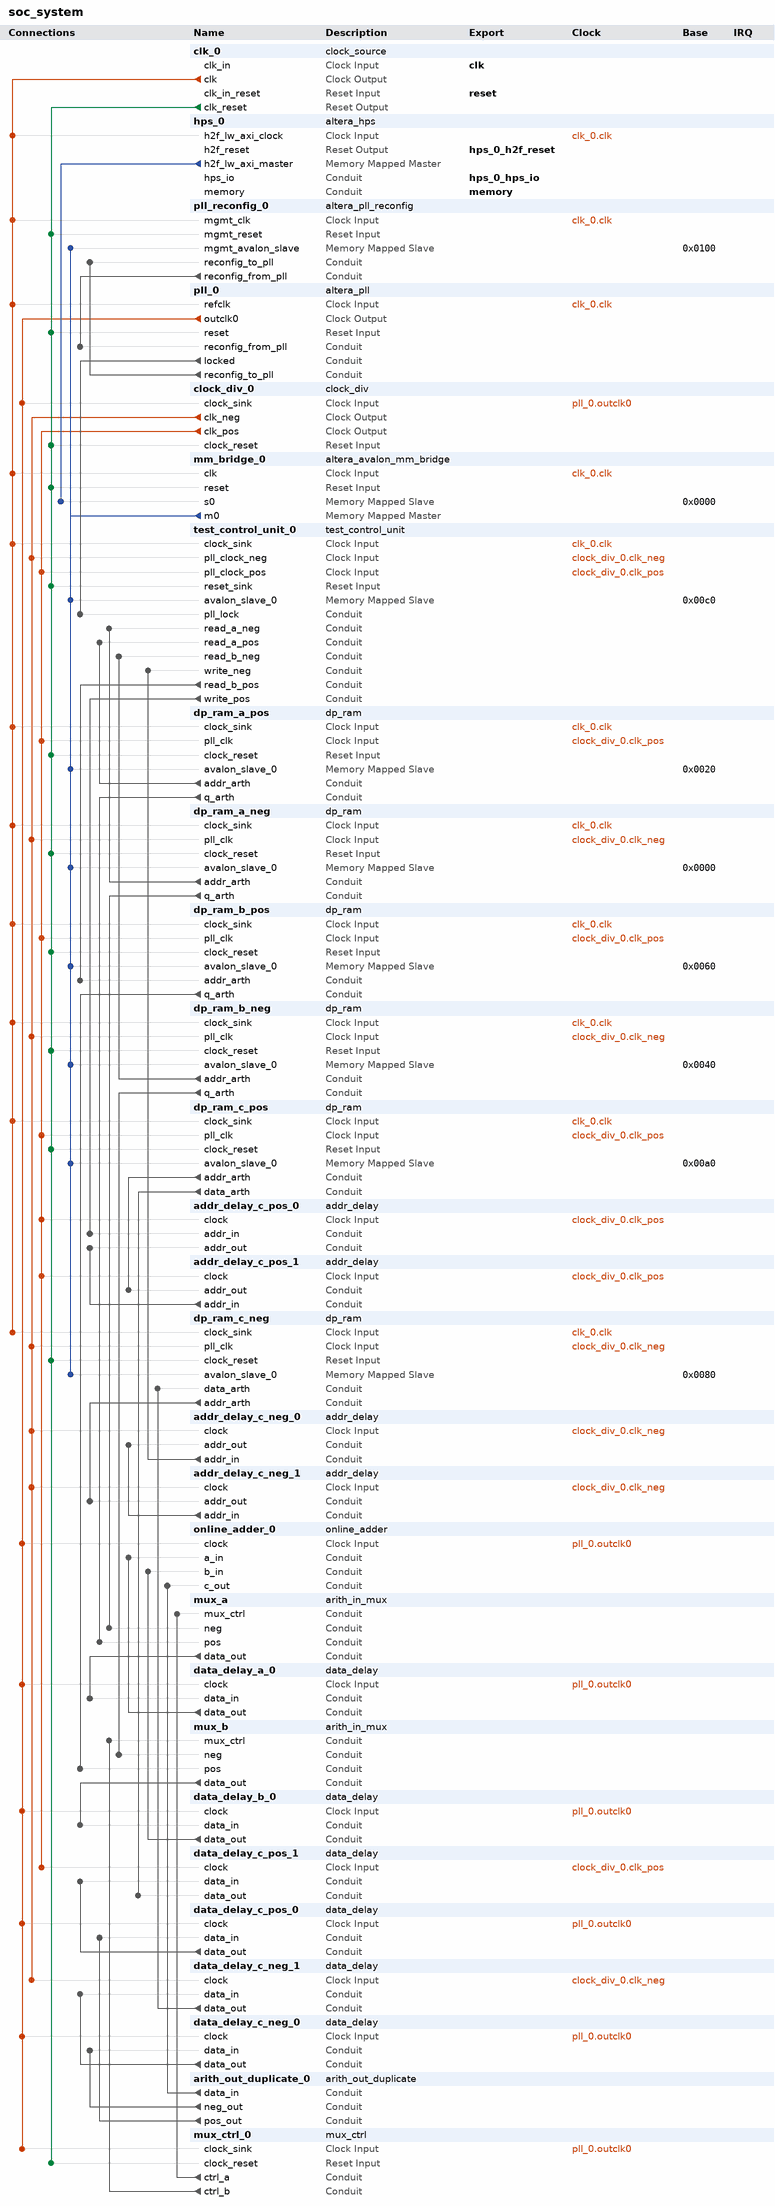
[diagram p0: system contents]
# Platform Designer (Qsys) system soc_system, Cyclone V 5CSXFC6D6F31C6
# Parameters at their usual value, and those the tool derives, are not listed.
package require -exact qsys 20.1
create_system soc_system
set_project_property DEVICE_FAMILY {Cyclone V}
set_project_property DEVICE 5CSXFC6D6F31C6

add_instance clk_0 clock_source 20.1
set_instance_parameter_value clk_0 clockFrequency 50000000

add_instance hps_0 altera_hps 20.1
set_instance_parameter_value hps_0 CAN0_Mode CAN
set_instance_parameter_value hps_0 CAN0_PinMuxing {HPS I/O Set 0}
set_instance_parameter_value hps_0 EMAC1_Mode RGMII
set_instance_parameter_value hps_0 EMAC1_PinMuxing {HPS I/O Set 0}
set_instance_parameter_value hps_0 F2SCLK_COLDRST_Enable false
set_instance_parameter_value hps_0 F2SCLK_DBGRST_Enable false
set_instance_parameter_value hps_0 F2SCLK_WARMRST_Enable false
set_instance_parameter_value hps_0 F2SINTERRUPT_Enable false
set_instance_parameter_value hps_0 F2S_Width 0
set_instance_parameter_value hps_0 FPGA_PERIPHERAL_OUTPUT_CLOCK_FREQ_EMAC0_GTX_CLK 100
set_instance_parameter_value hps_0 FPGA_PERIPHERAL_OUTPUT_CLOCK_FREQ_EMAC0_MD_CLK 100.0
set_instance_parameter_value hps_0 FPGA_PERIPHERAL_OUTPUT_CLOCK_FREQ_EMAC1_GTX_CLK 100
set_instance_parameter_value hps_0 FPGA_PERIPHERAL_OUTPUT_CLOCK_FREQ_EMAC1_MD_CLK 100.0
set_instance_parameter_value hps_0 HPS_PROTOCOL DDR3
set_instance_parameter_value hps_0 I2C0_Mode I2C
set_instance_parameter_value hps_0 I2C0_PinMuxing {HPS I/O Set 1}
set_instance_parameter_value hps_0 I2C1_Mode N/A
set_instance_parameter_value hps_0 I2C1_PinMuxing Unused
set_instance_parameter_value hps_0 LWH2F_Enable true
set_instance_parameter_value hps_0 MEM_BANKADDR_WIDTH 3
set_instance_parameter_value hps_0 MEM_CLK_FREQ 400.0
set_instance_parameter_value hps_0 MEM_COL_ADDR_WIDTH 10
set_instance_parameter_value hps_0 MEM_DQ_WIDTH 40
set_instance_parameter_value hps_0 MEM_DRV_STR RZQ/6
set_instance_parameter_value hps_0 MEM_ROW_ADDR_WIDTH 15
set_instance_parameter_value hps_0 MEM_RTT_NOM RZQ/6
set_instance_parameter_value hps_0 MEM_RTT_WR {Dynamic ODT off}
set_instance_parameter_value hps_0 MEM_TCL 7
set_instance_parameter_value hps_0 MEM_TFAW_NS 30.0
set_instance_parameter_value hps_0 MEM_TRAS_NS 35.0
set_instance_parameter_value hps_0 MEM_TRCD_NS 13.75
set_instance_parameter_value hps_0 MEM_TRFC_NS 260.0
set_instance_parameter_value hps_0 MEM_TRP_NS 13.75
set_instance_parameter_value hps_0 MEM_TRRD_NS 10.0
set_instance_parameter_value hps_0 MEM_TRTP_NS 10.0
set_instance_parameter_value hps_0 MEM_VENDOR JEDEC
set_instance_parameter_value hps_0 MEM_WTCL 6
set_instance_parameter_value hps_0 QSPI_Mode {1 SS}
set_instance_parameter_value hps_0 QSPI_PinMuxing {HPS I/O Set 0}
set_instance_parameter_value hps_0 REF_CLK_FREQ 25.0
set_instance_parameter_value hps_0 S2FCLK_USER2CLK 5
set_instance_parameter_value hps_0 S2F_Width 0
set_instance_parameter_value hps_0 SDIO_Mode {4-bit Data}
set_instance_parameter_value hps_0 SDIO_PinMuxing {HPS I/O Set 0}
set_instance_parameter_value hps_0 SPIM0_Mode {Single Slave Select}
set_instance_parameter_value hps_0 SPIM0_PinMuxing {HPS I/O Set 0}
set_instance_parameter_value hps_0 SPIM1_Mode N/A
set_instance_parameter_value hps_0 SPIM1_PinMuxing Unused
set_instance_parameter_value hps_0 STM_Enable false
set_instance_parameter_value hps_0 TIMING_BOARD_AC_SKEW 0.02
set_instance_parameter_value hps_0 TIMING_BOARD_AC_TO_CK_SKEW 0.0
set_instance_parameter_value hps_0 TIMING_BOARD_DQ_TO_DQS_SKEW 0.0
set_instance_parameter_value hps_0 TIMING_BOARD_MAX_CK_DELAY 0.6
set_instance_parameter_value hps_0 TIMING_BOARD_MAX_DQS_DELAY 0.6
set_instance_parameter_value hps_0 TIMING_BOARD_SKEW_BETWEEN_DQS 0.02
set_instance_parameter_value hps_0 TIMING_BOARD_SKEW_CKDQS_DIMM_MAX 0.01
set_instance_parameter_value hps_0 TIMING_BOARD_SKEW_CKDQS_DIMM_MIN -0.01
set_instance_parameter_value hps_0 TIMING_BOARD_SKEW_WITHIN_DQS 0.02
set_instance_parameter_value hps_0 TIMING_TDH 45
set_instance_parameter_value hps_0 TIMING_TDQSCK 225
set_instance_parameter_value hps_0 TIMING_TDQSQ 100
set_instance_parameter_value hps_0 TIMING_TDQSS 0.27
set_instance_parameter_value hps_0 TIMING_TDS 10
set_instance_parameter_value hps_0 TIMING_TDSH 0.18
set_instance_parameter_value hps_0 TIMING_TDSS 0.18
set_instance_parameter_value hps_0 TIMING_TIH 120
set_instance_parameter_value hps_0 TIMING_TIS 170
set_instance_parameter_value hps_0 TIMING_TQSH 0.4
set_instance_parameter_value hps_0 TRACE_Mode HPS
set_instance_parameter_value hps_0 TRACE_PinMuxing {HPS I/O Set 0}
set_instance_parameter_value hps_0 UART0_Mode {No Flow Control}
set_instance_parameter_value hps_0 UART0_PinMuxing {HPS I/O Set 2}
set_instance_parameter_value hps_0 USB1_Mode SDR
set_instance_parameter_value hps_0 USB1_PinMuxing {HPS I/O Set 0}
set_instance_parameter_value hps_0 desired_cfg_clk_mhz 123.333333
set_instance_parameter_value hps_0 desired_qspi_clk_mhz 370.0

add_instance pll_reconfig_0 altera_pll_reconfig 20.1

add_instance pll_0 altera_pll 20.1
set_instance_parameter_value pll_0 gui_device_speed_grade 1
set_instance_parameter_value pll_0 gui_en_adv_params true
set_instance_parameter_value pll_0 gui_en_reconf true
set_instance_parameter_value pll_0 gui_number_of_clocks 1
set_instance_parameter_value pll_0 gui_operation_mode normal
set_instance_parameter_value pll_0 gui_output_clock_frequency0 100.0
set_instance_parameter_value pll_0 gui_pll_mode {Fractional-N PLL}
set_instance_parameter_value pll_0 gui_reference_clock_frequency 50.0
set_instance_parameter_value pll_0 gui_use_locked true

add_instance clock_div_0 clock_div 1.0

add_instance mm_bridge_0 altera_avalon_mm_bridge 20.1
set_instance_parameter_value mm_bridge_0 ADDRESS_UNITS SYMBOLS
set_instance_parameter_value mm_bridge_0 ADDRESS_WIDTH 10
set_instance_parameter_value mm_bridge_0 DATA_WIDTH 32
set_instance_parameter_value mm_bridge_0 MAX_PENDING_RESPONSES 4
set_instance_parameter_value mm_bridge_0 USE_AUTO_ADDRESS_WIDTH 1

add_instance test_control_unit_0 test_control_unit 1.0
set_instance_parameter_value test_control_unit_0 ID 1

add_instance dp_ram_a_pos dp_ram 1.0
set_instance_parameter_value dp_ram_a_pos ID 2
set_instance_parameter_value dp_ram_a_pos NEG_EDGE 0

add_instance dp_ram_a_neg dp_ram 1.0
set_instance_parameter_value dp_ram_a_neg ID 3
set_instance_parameter_value dp_ram_a_neg NEG_EDGE 0

add_instance dp_ram_b_pos dp_ram 1.0
set_instance_parameter_value dp_ram_b_pos ID 4
set_instance_parameter_value dp_ram_b_pos NEG_EDGE 0

add_instance dp_ram_b_neg dp_ram 1.0
set_instance_parameter_value dp_ram_b_neg ID 5
set_instance_parameter_value dp_ram_b_neg NEG_EDGE 0

add_instance dp_ram_c_pos dp_ram 1.0
set_instance_parameter_value dp_ram_c_pos ID 6
set_instance_parameter_value dp_ram_c_pos NEG_EDGE 0

add_instance addr_delay_c_pos_0 addr_delay 1.0
set_instance_parameter_value addr_delay_c_pos_0 ADDR_WIDTH 11

add_instance addr_delay_c_pos_1 addr_delay 1.0
set_instance_parameter_value addr_delay_c_pos_1 ADDR_WIDTH 11

add_instance dp_ram_c_neg dp_ram 1.0
set_instance_parameter_value dp_ram_c_neg ID 7
set_instance_parameter_value dp_ram_c_neg NEG_EDGE 0

add_instance addr_delay_c_neg_0 addr_delay 1.0
set_instance_parameter_value addr_delay_c_neg_0 ADDR_WIDTH 11

add_instance addr_delay_c_neg_1 addr_delay 1.0
set_instance_parameter_value addr_delay_c_neg_1 ADDR_WIDTH 11

add_instance online_adder_0 online_adder 1.0
set_instance_parameter_value online_adder_0 RADIX 2
set_instance_parameter_value online_adder_0 WIDTH 15

add_instance mux_a arith_in_mux 1.0
set_instance_parameter_value mux_a WIDTH 30

add_instance data_delay_a_0 data_delay 1.0
set_instance_parameter_value data_delay_a_0 WIDTH 30

add_instance mux_b arith_in_mux 1.0
set_instance_parameter_value mux_b WIDTH 30

add_instance data_delay_b_0 data_delay 1.0
set_instance_parameter_value data_delay_b_0 WIDTH 30

add_instance data_delay_c_pos_1 data_delay 1.0
set_instance_parameter_value data_delay_c_pos_1 WIDTH 32

add_instance data_delay_c_pos_0 data_delay 1.0
set_instance_parameter_value data_delay_c_pos_0 WIDTH 32

add_instance data_delay_c_neg_1 data_delay 1.0
set_instance_parameter_value data_delay_c_neg_1 WIDTH 32

add_instance data_delay_c_neg_0 data_delay 1.0
set_instance_parameter_value data_delay_c_neg_0 WIDTH 32

add_instance arith_out_duplicate_0 arith_out_duplicate 1.0
set_instance_parameter_value arith_out_duplicate_0 WIDTH 32

add_instance mux_ctrl_0 mux_ctrl 1.0

# connections
add_connection clk_0.clk dp_ram_a_neg.clock_sink clock
add_connection clk_0.clk dp_ram_a_pos.clock_sink clock
add_connection clk_0.clk dp_ram_b_neg.clock_sink clock
add_connection clk_0.clk dp_ram_b_pos.clock_sink clock
add_connection clk_0.clk dp_ram_c_neg.clock_sink clock
add_connection clk_0.clk dp_ram_c_pos.clock_sink clock
add_connection clk_0.clk hps_0.h2f_lw_axi_clock clock
add_connection clk_0.clk mm_bridge_0.clk clock
add_connection clk_0.clk pll_0.refclk clock
add_connection clk_0.clk pll_reconfig_0.mgmt_clk clock
add_connection clk_0.clk test_control_unit_0.clock_sink clock
add_connection clock_div_0.clk_neg addr_delay_c_neg_0.clock clock
add_connection clock_div_0.clk_neg addr_delay_c_neg_1.clock clock
add_connection clock_div_0.clk_neg data_delay_c_neg_1.clock clock
add_connection clock_div_0.clk_neg dp_ram_a_neg.pll_clk clock
add_connection clock_div_0.clk_neg dp_ram_b_neg.pll_clk clock
add_connection clock_div_0.clk_neg dp_ram_c_neg.pll_clk clock
add_connection clock_div_0.clk_neg test_control_unit_0.pll_clock_neg clock
add_connection clock_div_0.clk_pos addr_delay_c_pos_0.clock clock
add_connection clock_div_0.clk_pos addr_delay_c_pos_1.clock clock
add_connection clock_div_0.clk_pos data_delay_c_pos_1.clock clock
add_connection clock_div_0.clk_pos dp_ram_a_pos.pll_clk clock
add_connection clock_div_0.clk_pos dp_ram_b_pos.pll_clk clock
add_connection clock_div_0.clk_pos dp_ram_c_pos.pll_clk clock
add_connection clock_div_0.clk_pos test_control_unit_0.pll_clock_pos clock
add_connection pll_0.outclk0 clock_div_0.clock_sink clock
add_connection pll_0.outclk0 data_delay_a_0.clock clock
add_connection pll_0.outclk0 data_delay_b_0.clock clock
add_connection pll_0.outclk0 data_delay_c_neg_0.clock clock
add_connection pll_0.outclk0 data_delay_c_pos_0.clock clock
add_connection pll_0.outclk0 mux_ctrl_0.clock_sink clock
add_connection pll_0.outclk0 online_adder_0.clock clock
add_connection clk_0.clk_reset clock_div_0.clock_reset reset
add_connection clk_0.clk_reset dp_ram_a_neg.clock_reset reset
add_connection clk_0.clk_reset dp_ram_a_pos.clock_reset reset
add_connection clk_0.clk_reset dp_ram_b_neg.clock_reset reset
add_connection clk_0.clk_reset dp_ram_b_pos.clock_reset reset
add_connection clk_0.clk_reset dp_ram_c_neg.clock_reset reset
add_connection clk_0.clk_reset dp_ram_c_pos.clock_reset reset
add_connection clk_0.clk_reset mm_bridge_0.reset reset
add_connection clk_0.clk_reset mux_ctrl_0.clock_reset reset
add_connection clk_0.clk_reset pll_0.reset reset
add_connection clk_0.clk_reset pll_reconfig_0.mgmt_reset reset
add_connection clk_0.clk_reset test_control_unit_0.reset_sink reset
add_connection hps_0.h2f_lw_axi_master mm_bridge_0.s0 avalon
set_connection_parameter_value hps_0.h2f_lw_axi_master/mm_bridge_0.s0 baseAddress 0x0000
add_connection mm_bridge_0.m0 dp_ram_a_neg.avalon_slave_0 avalon
set_connection_parameter_value mm_bridge_0.m0/dp_ram_a_neg.avalon_slave_0 baseAddress 0x0000
add_connection mm_bridge_0.m0 dp_ram_a_pos.avalon_slave_0 avalon
set_connection_parameter_value mm_bridge_0.m0/dp_ram_a_pos.avalon_slave_0 baseAddress 0x0020
add_connection mm_bridge_0.m0 dp_ram_b_neg.avalon_slave_0 avalon
set_connection_parameter_value mm_bridge_0.m0/dp_ram_b_neg.avalon_slave_0 baseAddress 0x0040
add_connection mm_bridge_0.m0 dp_ram_b_pos.avalon_slave_0 avalon
set_connection_parameter_value mm_bridge_0.m0/dp_ram_b_pos.avalon_slave_0 baseAddress 0x0060
add_connection mm_bridge_0.m0 dp_ram_c_neg.avalon_slave_0 avalon
set_connection_parameter_value mm_bridge_0.m0/dp_ram_c_neg.avalon_slave_0 baseAddress 0x0080
add_connection mm_bridge_0.m0 dp_ram_c_pos.avalon_slave_0 avalon
set_connection_parameter_value mm_bridge_0.m0/dp_ram_c_pos.avalon_slave_0 baseAddress 0x00a0
add_connection mm_bridge_0.m0 pll_reconfig_0.mgmt_avalon_slave avalon
set_connection_parameter_value mm_bridge_0.m0/pll_reconfig_0.mgmt_avalon_slave baseAddress 0x0100
add_connection mm_bridge_0.m0 test_control_unit_0.avalon_slave_0 avalon
set_connection_parameter_value mm_bridge_0.m0/test_control_unit_0.avalon_slave_0 baseAddress 0x00c0
add_connection addr_delay_c_neg_0.addr_in test_control_unit_0.write_neg conduit
add_connection addr_delay_c_neg_1.addr_in addr_delay_c_neg_0.addr_out conduit
add_connection addr_delay_c_pos_1.addr_in addr_delay_c_pos_0.addr_out conduit
add_connection arith_out_duplicate_0.data_in online_adder_0.c_out conduit
add_connection arith_out_duplicate_0.neg_out data_delay_c_neg_0.data_in conduit
add_connection arith_out_duplicate_0.pos_out data_delay_c_pos_0.data_in conduit
add_connection data_delay_a_0.data_out online_adder_0.a_in conduit
add_connection data_delay_b_0.data_out online_adder_0.b_in conduit
add_connection data_delay_c_neg_0.data_out data_delay_c_neg_1.data_in conduit
add_connection data_delay_c_neg_1.data_out dp_ram_c_neg.data_arth conduit
add_connection data_delay_c_pos_0.data_out data_delay_c_pos_1.data_in conduit
add_connection dp_ram_a_neg.addr_arth test_control_unit_0.read_a_neg conduit
add_connection dp_ram_a_neg.q_arth mux_a.neg conduit
add_connection dp_ram_a_pos.addr_arth test_control_unit_0.read_a_pos conduit
add_connection dp_ram_a_pos.q_arth mux_a.pos conduit
add_connection dp_ram_b_neg.addr_arth test_control_unit_0.read_b_neg conduit
add_connection dp_ram_b_neg.q_arth mux_b.neg conduit
add_connection dp_ram_b_pos.q_arth mux_b.pos conduit
add_connection dp_ram_c_neg.addr_arth addr_delay_c_neg_1.addr_out conduit
add_connection dp_ram_c_pos.addr_arth addr_delay_c_pos_1.addr_out conduit
add_connection dp_ram_c_pos.data_arth data_delay_c_pos_1.data_out conduit
add_connection mux_a.data_out data_delay_a_0.data_in conduit
add_connection mux_b.data_out data_delay_b_0.data_in conduit
add_connection mux_ctrl_0.ctrl_a mux_a.mux_ctrl conduit
add_connection mux_ctrl_0.ctrl_b mux_b.mux_ctrl conduit
add_connection pll_0.locked test_control_unit_0.pll_lock conduit
add_connection pll_0.reconfig_to_pll pll_reconfig_0.reconfig_to_pll conduit
add_connection pll_reconfig_0.reconfig_from_pll pll_0.reconfig_from_pll conduit
add_connection test_control_unit_0.read_b_pos dp_ram_b_pos.addr_arth conduit
add_connection test_control_unit_0.write_pos addr_delay_c_pos_0.addr_in conduit

# exported interfaces
add_interface clk clock sink
set_interface_property clk EXPORT_OF clk_0.clk_in
add_interface hps_0_h2f_reset reset source
set_interface_property hps_0_h2f_reset EXPORT_OF hps_0.h2f_reset
add_interface hps_0_hps_io conduit end
set_interface_property hps_0_hps_io EXPORT_OF hps_0.hps_io
add_interface memory conduit end
set_interface_property memory EXPORT_OF hps_0.memory
add_interface reset reset sink
set_interface_property reset EXPORT_OF clk_0.clk_in_reset

set_interconnect_requirement {$system} qsys_mm.clockCrossingAdapter HANDSHAKE
set_interconnect_requirement {$system} qsys_mm.insertDefaultSlave FALSE
set_interconnect_requirement {$system} qsys_mm.maxAdditionalLatency 0
set_interconnect_requirement hps_only_master.master qsys_mm.security SECURE

save_system soc_system.qsys
